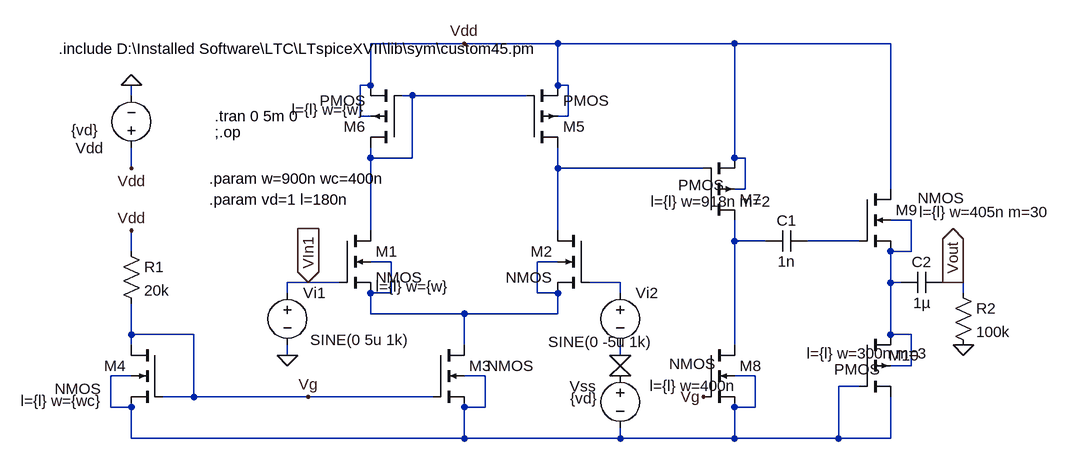
[diagram p0: schematic OpAmp.asc]
OpAmp.asc, the LTspice schematic file:
Version 4
SHEET 1 964 680
WIRE 128 -48 -16 -48
WIRE 272 -48 128 -48
WIRE 544 -48 272 -48
WIRE 784 -48 544 -48
WIRE -16 16 -16 -48
WIRE -16 16 -32 16
WIRE 272 16 272 -48
WIRE 288 16 272 16
WIRE -384 32 -384 16
WIRE 48 32 32 32
WIRE 224 32 48 32
WIRE -32 64 -32 16
WIRE -16 64 -32 64
WIRE 288 64 288 16
WIRE 288 64 272 64
WIRE -16 128 -16 112
WIRE 48 128 48 32
WIRE 48 128 -16 128
WIRE 544 128 544 -48
WIRE 560 128 544 128
WIRE -384 144 -384 112
WIRE 272 144 272 112
WIRE 496 144 272 144
WIRE 560 176 560 128
WIRE 560 176 544 176
WIRE 784 176 784 -48
WIRE 816 224 784 224
WIRE -16 240 -16 128
WIRE 272 240 272 144
WIRE 544 256 544 224
WIRE 592 256 544 256
WIRE 736 256 656 256
WIRE -384 272 -384 240
WIRE 816 272 816 224
WIRE 816 272 784 272
WIRE 16 288 -16 288
WIRE 272 288 240 288
WIRE -112 320 -144 320
WIRE -64 320 -112 320
WIRE 368 320 320 320
WIRE 784 320 784 272
WIRE 800 320 784 320
WIRE 880 320 864 320
WIRE 896 320 880 320
WIRE -144 336 -144 320
WIRE 16 336 16 288
WIRE 16 336 -16 336
WIRE 240 336 240 288
WIRE 272 336 240 336
WIRE 368 336 368 320
WIRE 896 336 896 320
WIRE -16 368 -16 336
WIRE 128 368 -16 368
WIRE 272 368 272 336
WIRE 272 368 128 368
WIRE -384 400 -384 352
WIRE -288 400 -384 400
WIRE 784 400 784 320
WIRE 816 400 784 400
WIRE -384 416 -384 400
WIRE 128 416 128 368
WIRE 544 416 544 256
WIRE -144 432 -144 416
WIRE 368 432 368 416
WIRE 816 448 816 400
WIRE 816 448 784 448
WIRE -384 464 -416 464
WIRE 160 464 128 464
WIRE 576 464 544 464
WIRE 736 480 704 480
WIRE -288 496 -288 400
WIRE -288 496 -336 496
WIRE -112 496 -288 496
WIRE 80 496 -112 496
WIRE -416 512 -416 464
WIRE -384 512 -416 512
WIRE 160 512 160 464
WIRE 160 512 128 512
WIRE 576 512 576 464
WIRE 576 512 544 512
WIRE -384 560 -384 512
WIRE 128 560 128 512
WIRE 128 560 -384 560
WIRE 368 560 368 544
WIRE 368 560 128 560
WIRE 544 560 544 512
WIRE 544 560 368 560
WIRE 704 560 704 480
WIRE 704 560 544 560
WIRE 784 560 784 496
WIRE 784 560 704 560
FLAG -384 16 0
FLAG 128 -48 Vdd
FLAG -384 144 Vdd
FLAG -384 240 Vdd
FLAG -112 320 VIn1
IOPIN -112 320 In
FLAG -144 432 0
FLAG 368 432 0
FLAG 368 464 0
FLAG -112 496 Vg
FLAG 496 496 Vg
FLAG 880 320 Vout
IOPIN 880 320 Out
FLAG 896 416 0
DATAFLAG -16 0 ""
DATAFLAG -16 160 ""
DATAFLAG 176 368 ""
DATAFLAG 192 560 ""
DATAFLAG 192 560 ""
DATAFLAG 16 496 ""
DATAFLAG -384 400 ""
DATAFLAG 544 64 ""
DATAFLAG 400 144 ""
DATAFLAG 544 288 ""
DATAFLAG 784 352 ""
DATAFLAG 688 256 ""
DATAFLAG 704 496 ""
SYMBOL voltage -384 128 R180
WINDOW 3 51 43 Left 2
WINDOW 123 0 0 Left 0
WINDOW 39 0 0 Left 0
WINDOW 0 43 15 Left 2
SYMATTR Value {vd}
SYMATTR InstName Vdd
SYMBOL voltage 368 448 R0
WINDOW 3 -77 50 Left 2
WINDOW 123 0 0 Left 0
WINDOW 39 0 0 Left 0
WINDOW 0 -78 32 Left 2
SYMATTR Value {vd}
SYMATTR InstName Vss
SYMBOL res -400 256 R0
SYMATTR InstName R1
SYMATTR Value 20k
SYMBOL nmos4 -64 240 R0
WINDOW 123 56 86 Left 2
SYMATTR Value2 l={l} w={w}
SYMATTR InstName M1
SYMBOL nmos4 320 240 M0
SYMATTR Value2 l={l} w={w}
SYMATTR InstName M2
SYMBOL nmos4 80 416 R0
WINDOW 3 83 32 Left 2
SYMATTR Value2 l={l} w={wc}
SYMATTR InstName M3
SYMBOL nmos4 -336 416 M0
WINDOW 123 93 86 Left 2
WINDOW 3 94 68 Left 2
SYMATTR Value2 l={l} w={wc}
SYMATTR InstName M4
SYMBOL pmos4 224 112 M180
SYMATTR InstName M5
SYMATTR Value2 l={l} w={w}
SYMBOL pmos4 32 112 R180
WINDOW 123 56 58 Left 2
SYMATTR Value2 l={l} w={w}
SYMATTR InstName M6
SYMBOL voltage -144 320 R0
WINDOW 123 34 67 Left 2
WINDOW 39 0 0 Left 0
WINDOW 3 35 88 Left 2
SYMATTR Value SINE(0 5u 1k)
SYMATTR InstName Vi1
SYMBOL voltage 368 320 R0
WINDOW 123 34 67 Left 2
WINDOW 39 0 0 Left 0
WINDOW 3 -111 91 Left 2
SYMATTR Value SINE(0 -5u 1k)
SYMATTR InstName Vi2
SYMBOL pmos4 496 224 M180
WINDOW 123 -81 29 Left 2
WINDOW 3 -39 54 Left 2
SYMATTR Value2 l={l} w=918n m=2
SYMATTR InstName M7
SYMBOL nmos4 496 416 R0
WINDOW 123 -83 63 Left 2
WINDOW 3 -53 29 Left 2
SYMATTR Value2 l={l} w=400n
SYMATTR InstName M8
SYMBOL cap 656 240 R90
WINDOW 0 0 32 VBottom 2
WINDOW 3 32 32 VTop 2
SYMATTR InstName C1
SYMATTR Value 1n
SYMBOL nmos4 736 176 R0
WINDOW 123 92 35 Left 2
WINDOW 3 90 14 Left 2
SYMATTR Value2 l={l} w=405n m=30
SYMATTR InstName M9
SYMBOL pmos4 736 400 R0
WINDOW 123 -81 29 Left 2
WINDOW 3 -39 54 Left 2
WINDOW 0 45 32 Left 2
SYMATTR Value2 l={l} w=300n m=3
SYMATTR InstName M10
SYMBOL cap 864 304 R90
WINDOW 0 0 32 VBottom 2
WINDOW 3 32 32 VTop 2
SYMATTR InstName C2
SYMATTR Value 1µ
SYMBOL res 880 320 R0
SYMATTR InstName R2
SYMATTR Value 100k
TEXT -256 64 Left 2 !.tran 0 5m 0
TEXT -256 88 Left 2 !;.op
TEXT -264 192 Left 2 !.param vd=1 l=180n
TEXT -496 -40 Left 2 !.include D:\\Installed Software\\LTC\\LTspiceXVII\\lib\\sym\\custom45.pm
TEXT -264 160 Left 2 !.param w=900n wc=400n

The netlist it stands for:
* OpAmp.asc
Vdd Vdd 0 {vd}
Vss 0 N008 {vd}
R1 Vdd Vg 20k
M1 N001 VIn1 N006 N006 NMOS l={l} w={w}
M2 N002 N007 N006 N006 NMOS l={l} w={w}
M3 N006 Vg N008 N008 NMOS l={l} w={wc}
M4 Vg Vg N008 N008 NMOS l={l} w={wc}
M5 N002 N001 Vdd Vdd PMOS l={l} w={w}
M6 N001 N001 Vdd Vdd PMOS l={l} w={w}
Vi1 VIn1 0 SINE(0 5u 1k)
Vi2 N007 0 SINE(0 -5u 1k)
M7 N004 N002 Vdd Vdd PMOS l={l} w=918n m=2
M8 N004 Vg N008 N008 NMOS l={l} w=400n
C1 N005 N004 1n
M9 Vdd N005 N003 N003 NMOS l={l} w=405n m=30
M10 N003 N008 N008 N003 PMOS l={l} w=300n m=3
C2 Vout N003 1µ
R2 Vout 0 100k
.model NMOS NMOS
.model PMOS PMOS
.lib standard.mos
.tran 0 5m 0
;.op
.param vd=1 l=180n
.include D:\Installed Software\LTC\LTspiceXVII\lib\sym\custom45.pm
.param w=900n wc=400n
.backanno
.end